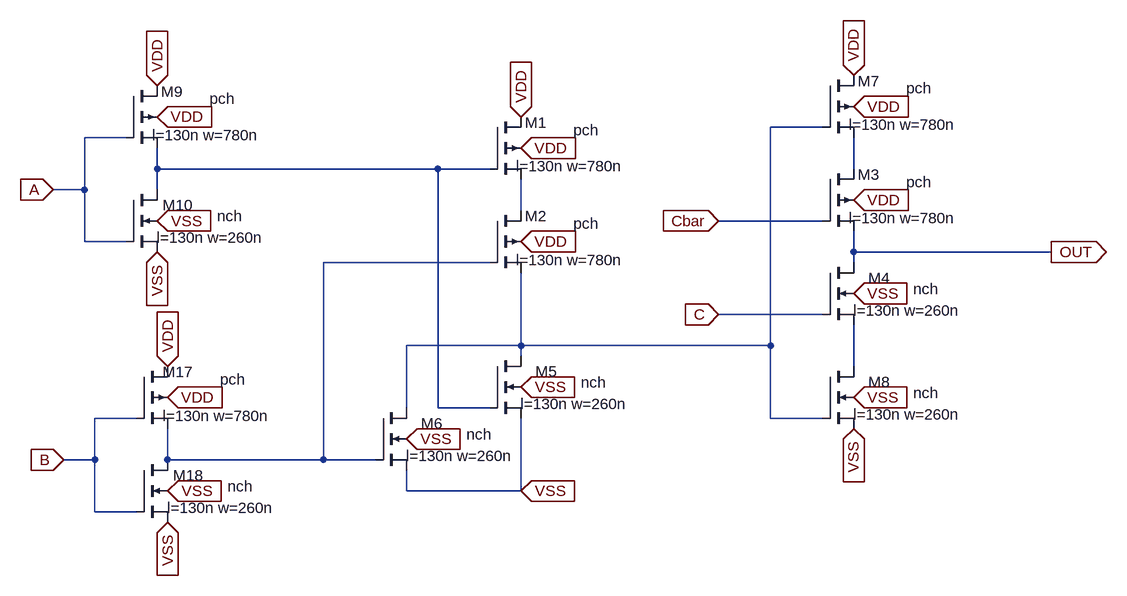
[diagram p0: schematic Or23state.asc]
Or23state.asc, the LTspice schematic file:
Version 4.1
SHEET 1 3404 1048
WIRE 2944 336 2864 336
WIRE 1872 352 1808 352
WIRE 1920 400 1920 368
WIRE 2352 400 1920 400
WIRE 2432 400 2352 400
WIRE 2992 400 2992 352
WIRE 1808 432 1808 352
WIRE 1808 432 1760 432
WIRE 1920 432 1920 400
WIRE 2480 464 2480 416
WIRE 2944 480 2784 480
WIRE 1808 512 1808 432
WIRE 1872 512 1808 512
WIRE 2992 528 2992 496
WIRE 3296 528 2992 528
WIRE 2432 544 2176 544
WIRE 2992 544 2992 528
WIRE 2944 624 2784 624
WIRE 2480 672 2480 560
WIRE 2480 672 2304 672
WIRE 2864 672 2864 336
WIRE 2864 672 2480 672
WIRE 2480 688 2480 672
WIRE 2992 704 2992 640
WIRE 2304 768 2304 672
WIRE 2352 768 2352 400
WIRE 2432 768 2352 768
WIRE 1888 784 1824 784
WIRE 2864 784 2864 672
WIRE 2944 784 2864 784
WIRE 1824 848 1824 784
WIRE 1824 848 1776 848
WIRE 1936 848 1936 800
WIRE 2176 848 2176 544
WIRE 2176 848 1936 848
WIRE 2256 848 2176 848
WIRE 2304 896 2304 864
WIRE 2480 896 2480 784
WIRE 2480 896 2304 896
WIRE 1824 928 1824 848
WIRE 1888 928 1824 928
FLAG 1920 272 VDD
IOPIN 1920 272 In
FLAG 1920 320 VDD
IOPIN 1920 320 In
FLAG 2480 320 VDD
IOPIN 2480 320 In
FLAG 2480 368 VDD
IOPIN 2480 368 In
FLAG 2480 512 VDD
IOPIN 2480 512 In
FLAG 2992 256 VDD
IOPIN 2992 256 In
FLAG 2992 304 VDD
IOPIN 2992 304 In
FLAG 2992 448 VDD
IOPIN 2992 448 In
FLAG 1936 704 VDD
IOPIN 1936 704 In
FLAG 1936 752 VDD
IOPIN 1936 752 In
FLAG 1920 480 VSS
IOPIN 1920 480 In
FLAG 1920 528 VSS
IOPIN 1920 528 In
FLAG 1936 896 VSS
IOPIN 1936 896 In
FLAG 1936 944 VSS
IOPIN 1936 944 In
FLAG 2480 736 VSS
IOPIN 2480 736 In
FLAG 2480 896 VSS
IOPIN 2480 896 In
FLAG 2992 752 VSS
IOPIN 2992 752 In
FLAG 2992 800 VSS
IOPIN 2992 800 In
FLAG 2992 592 VSS
IOPIN 2992 592 In
FLAG 2304 816 VSS
IOPIN 2304 816 In
FLAG 2784 480 Cbar
IOPIN 2784 480 In
FLAG 2784 624 C
IOPIN 2784 624 In
FLAG 1760 432 A
IOPIN 1760 432 In
FLAG 1776 848 B
IOPIN 1776 848 In
FLAG 3296 528 OUT
IOPIN 3296 528 Out
SYMBOL pmos4 2432 320 R0
WINDOW 0 88 9 Right 2
WINDOW 3 168 20 Right 2
WINDOW 123 206 76 Right 2
SYMATTR InstName M1
SYMATTR Value pch
SYMATTR Value2 l=130n w=780n
SYMBOL pmos4 2432 464 R0
WINDOW 0 88 9 Right 2
WINDOW 3 168 20 Right 2
WINDOW 123 206 76 Right 2
SYMATTR InstName M2
SYMATTR Value pch
SYMATTR Value2 l=130n w=780n
SYMBOL pmos4 2944 400 R0
WINDOW 0 88 9 Right 2
WINDOW 3 168 20 Right 2
WINDOW 123 206 76 Right 2
SYMATTR InstName M3
SYMATTR Value pch
SYMATTR Value2 l=130n w=780n
SYMBOL nmos4 2944 544 R0
WINDOW 0 104 24 Right 2
WINDOW 3 179 41 Right 2
WINDOW 123 213 74 Right 2
SYMATTR InstName M4
SYMATTR Value nch
SYMATTR Value2 l=130n w=260n
SYMBOL nmos4 2432 688 R0
WINDOW 0 104 24 Right 2
WINDOW 3 179 41 Right 2
WINDOW 123 213 74 Right 2
SYMATTR InstName M5
SYMATTR Value nch
SYMATTR Value2 l=130n w=260n
SYMBOL nmos4 2256 768 R0
WINDOW 0 104 24 Right 2
WINDOW 3 179 41 Right 2
WINDOW 123 213 74 Right 2
SYMATTR InstName M6
SYMATTR Value nch
SYMATTR Value2 l=130n w=260n
SYMBOL pmos4 2944 256 R0
WINDOW 0 88 9 Right 2
WINDOW 3 168 20 Right 2
WINDOW 123 206 76 Right 2
SYMATTR InstName M7
SYMATTR Value pch
SYMATTR Value2 l=130n w=780n
SYMBOL nmos4 2944 704 R0
WINDOW 0 104 24 Right 2
WINDOW 3 179 41 Right 2
WINDOW 123 213 74 Right 2
SYMATTR InstName M8
SYMATTR Value nch
SYMATTR Value2 l=130n w=260n
SYMBOL pmos4 1872 272 R0
WINDOW 0 88 9 Right 2
WINDOW 3 168 20 Right 2
WINDOW 123 206 76 Right 2
SYMATTR InstName M9
SYMATTR Value pch
SYMATTR Value2 l=130n w=780n
SYMBOL nmos4 1872 432 R0
WINDOW 0 104 24 Right 2
WINDOW 3 179 41 Right 2
WINDOW 123 213 74 Right 2
SYMATTR InstName M10
SYMATTR Value nch
SYMATTR Value2 l=130n w=260n
SYMBOL pmos4 1888 704 R0
WINDOW 0 88 9 Right 2
WINDOW 3 168 20 Right 2
WINDOW 123 206 76 Right 2
SYMATTR InstName M17
SYMATTR Value pch
SYMATTR Value2 l=130n w=780n
SYMBOL nmos4 1888 848 R0
WINDOW 0 104 24 Right 2
WINDOW 3 179 41 Right 2
WINDOW 123 213 74 Right 2
SYMATTR InstName M18
SYMATTR Value nch
SYMATTR Value2 l=130n w=260n

The netlist it stands for:
* Or23state.asc
M1 VDD N002 N004 VDD pch l=130n w=780n
M2 N004 N005 N001 VDD pch l=130n w=780n
M3 N003 Cbar OUT VDD pch l=130n w=780n
M4 OUT C N006 VSS nch l=130n w=260n
M5 N001 N002 VSS VSS nch l=130n w=260n
M6 N001 N005 VSS VSS nch l=130n w=260n
M7 VDD N001 N003 VDD pch l=130n w=780n
M8 N006 N001 VSS VSS nch l=130n w=260n
M9 VDD A N002 VDD pch l=130n w=780n
M10 N002 A VSS VSS nch l=130n w=260n
M17 VDD B N005 VDD pch l=130n w=780n
M18 N005 B VSS VSS nch l=130n w=260n
.model NMOS NMOS
.model PMOS PMOS
.lib standard.mos
.backanno
.end